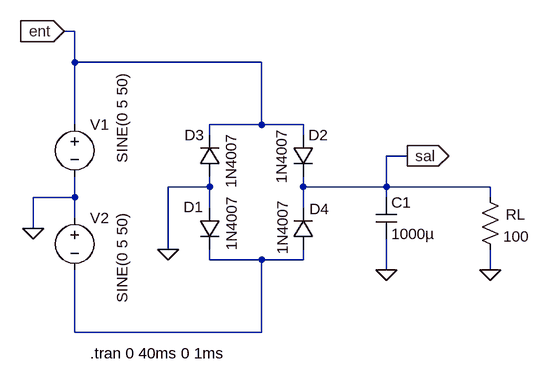
[diagram p0: schematic E3-filtro-C.asc]
E3-filtro-C.asc, the LTspice schematic file:
Version 4
SHEET 1 880 680
WIRE -528 -80 -544 -80
WIRE -528 -32 -528 -80
WIRE -240 -32 -528 -32
WIRE -528 64 -528 -32
WIRE -240 64 -240 -32
WIRE -240 64 -320 64
WIRE -176 64 -240 64
WIRE -320 80 -320 64
WIRE -176 80 -176 64
WIRE -16 112 -48 112
WIRE -320 160 -320 144
WIRE -320 160 -384 160
WIRE -176 160 -176 144
WIRE -48 160 -48 112
WIRE -48 160 -176 160
WIRE 112 160 -48 160
WIRE -528 176 -528 144
WIRE -528 176 -592 176
WIRE -48 176 -48 160
WIRE 112 176 112 160
WIRE -320 192 -320 160
WIRE -176 192 -176 160
WIRE -528 208 -528 176
WIRE -592 224 -592 176
WIRE -384 256 -384 160
WIRE -320 272 -320 256
WIRE -240 272 -320 272
WIRE -176 272 -176 256
WIRE -176 272 -240 272
WIRE -48 288 -48 240
WIRE 112 288 112 256
WIRE -528 384 -528 288
WIRE -240 384 -240 272
WIRE -240 384 -528 384
FLAG -48 288 0
FLAG 112 288 0
FLAG -544 -80 ent
IOPIN -544 -80 In
FLAG -16 112 sal
IOPIN -16 112 Out
FLAG -384 256 0
FLAG -592 224 0
SYMBOL voltage -528 48 R0
WINDOW 3 73 -64 VRight 2
WINDOW 123 -22 138 VLeft 2
WINDOW 39 0 0 Left 0
SYMATTR Value SINE(0 5 50)
SYMATTR InstName V1
SYMBOL cap -64 176 R0
SYMATTR InstName C1
SYMATTR Value 1000µ
SYMBOL res 96 160 R0
WINDOW 0 40 42 Left 2
SYMATTR InstName RL
SYMATTR Value 100
SYMBOL diode -336 192 R0
WINDOW 0 -24 -1 Left 2
WINDOW 3 50 -19 VRight 2
SYMATTR InstName D1
SYMATTR Value 1N4007
SYMBOL diode -192 80 R0
WINDOW 3 -17 -10 VRight 2
SYMATTR Value 1N4007
SYMATTR InstName D2
SYMBOL diode -304 144 R180
WINDOW 0 24 64 Left 2
WINDOW 3 -17 -18 VRight 2
SYMATTR InstName D3
SYMATTR Value 1N4007
SYMBOL diode -160 256 R180
WINDOW 0 -24 62 Left 2
WINDOW 3 48 -8 VRight 2
SYMATTR InstName D4
SYMATTR Value 1N4007
SYMBOL voltage -528 192 R0
WINDOW 3 73 147 VLeft 2
WINDOW 123 -22 138 VLeft 2
WINDOW 39 0 0 Left 0
SYMATTR Value SINE(0 5 50)
SYMATTR InstName V2
TEXT -504 416 Left 2 !.tran 0 40ms 0 1ms

The netlist it stands for:
* E3-filtro-C.asc
V1 ent 0 SINE(0 5 50)
C1 sal 0 1000µ
RL sal 0 100
D1 0 N001 1N4007
D2 ent sal 1N4007
D3 0 ent 1N4007
D4 N001 sal 1N4007
V2 0 N001 SINE(0 5 50)
.model D D
.lib standard.dio
.tran 0 40ms 0 1ms
.backanno
.end